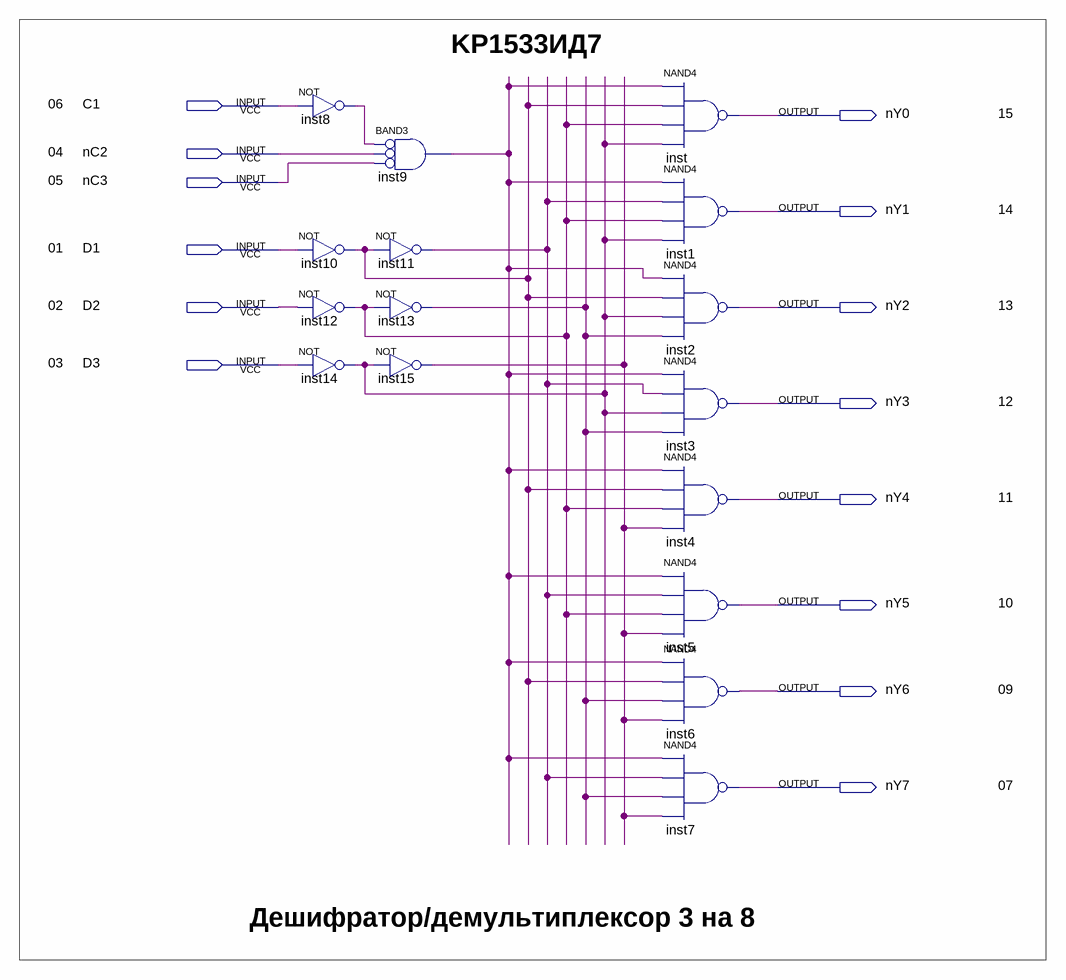
[diagram p0: schematic sheet]
// Quartus schematic KP1533ID7.bdf as structural Verilog: 16 symbols, 14 pins
module KP1533ID7 (
  input  C1,
  input  nC2,
  input  nC3,
  input  D1,
  input  D2,
  input  D3,
  output nY0,
  output nY1,
  output nY2,
  output nY3,
  output nY4,
  output nY5,
  output nY6,
  output nY7
);

  wire inst8_out, inst9_out, inst10_out, inst11_out, inst12_out, inst13_out, inst14_out, inst15_out;

  not inst8 (inst8_out, C1);
  not inst10 (inst10_out, D1);
  not inst12 (inst12_out, D2);
  not inst14 (inst14_out, D3);
  and inst9 (inst9_out, ~inst8_out, ~nC2, ~nC3);  // BAND3
  not inst11 (inst11_out, inst10_out);
  not inst13 (inst13_out, inst12_out);
  not inst15 (inst15_out, inst14_out);
  nand inst (nY0, inst9_out, inst10_out, inst12_out, inst14_out);
  nand inst1 (nY1, inst9_out, inst11_out, inst12_out, inst14_out);
  nand inst2 (nY2, inst9_out, inst10_out, inst14_out, inst13_out);
  nand inst3 (nY3, inst9_out, inst11_out, inst14_out, inst13_out);
  nand inst4 (nY4, inst9_out, inst10_out, inst12_out, inst15_out);
  nand inst5 (nY5, inst9_out, inst11_out, inst12_out, inst15_out);
  nand inst6 (nY6, inst9_out, inst10_out, inst13_out, inst15_out);
  nand inst7 (nY7, inst9_out, inst11_out, inst13_out, inst15_out);

  // Notes on the sheet:
  //   KP1533ИД7
  //   06
  //   15
  //   04
  //   05
  //   14
  //   01
  //   02
  //   13
  //   03
  //   12
  //   11
  //   10
  //   09
  //   07
  //   Дешифратор/демультиплексор 3 на 8
endmodule
